# EAGLE design Link232-wifi-c64 (EAGLE 9.6.2)
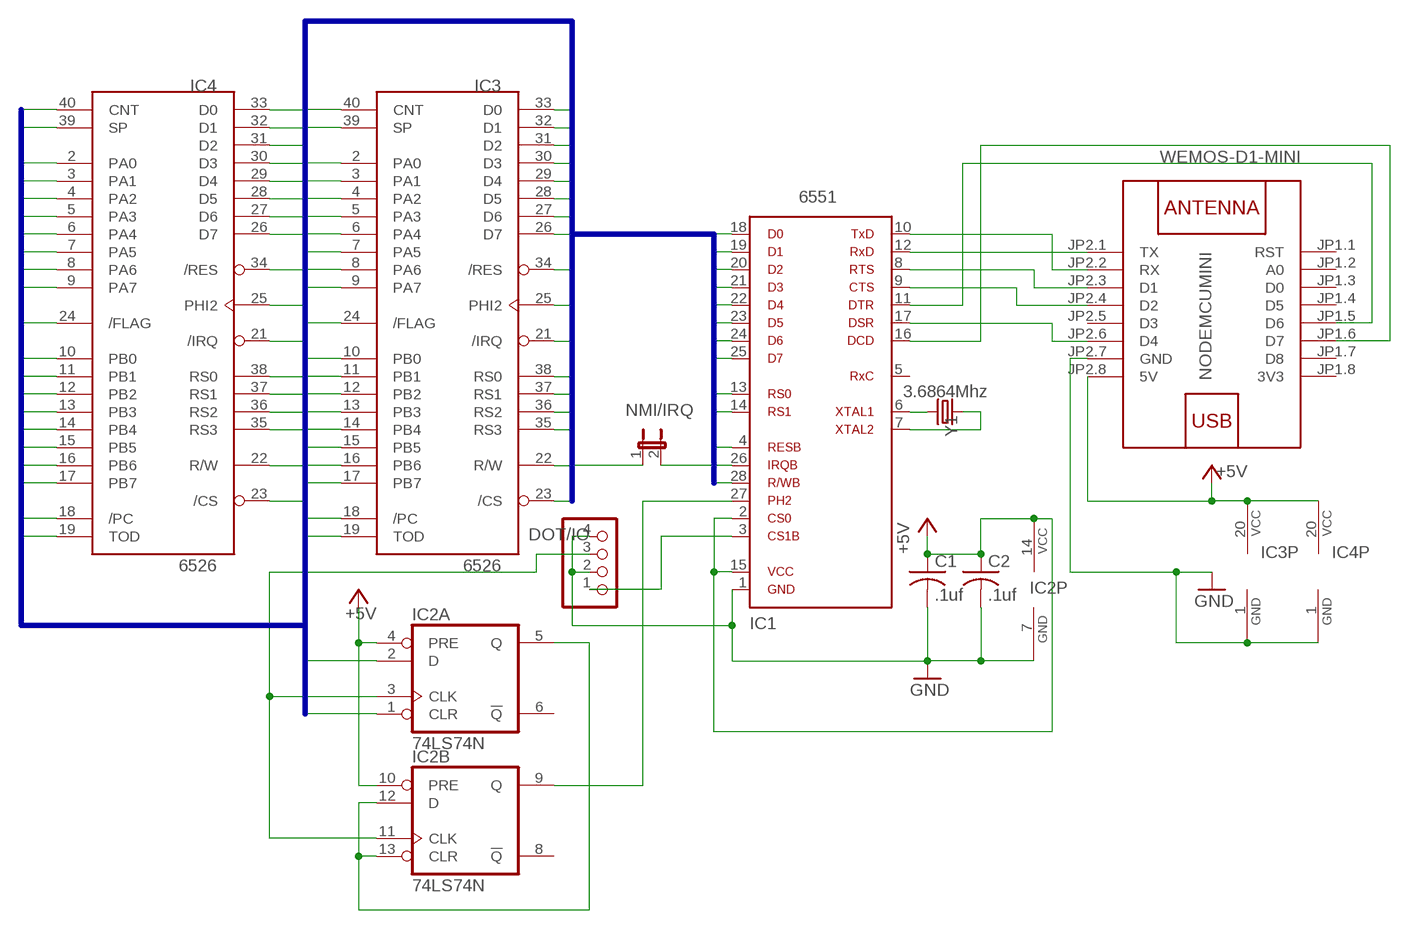
[diagram p0: schematic, sheet 1]

## Parts
C1  .1uf  C-US050-024X044  [C050-024X044]
C2  .1uf  C-US050-024X044  [C050-024X044]
IC1  6551  [6551]
IC2  74LS74N  [DIL14]
IC3  6526  [DIP40]
IC4  6526  [DIP40]
JP1  NMI/IRQ  JP1E  [JP1]
JP2  DOT/IO  PINHD-1X4  [1X04]
NODEMCUMINI  WEMOS-D1-MINI  [WEMOS-D1-MINI]
Y1  3.6864Mhz  CRYSTALPTH-HC49US  [HC49US]

## Nets
+5V: C1.1 C2.1 IC1.2 IC1.15 IC2.4(A:PRE) IC2.10(B:PRE) IC2.14(P:VCC) IC3.20(VCC) IC4.20(VCC) NODEMCUMINI.JP2.8(5V)
/CS: IC3.23(/CS) IC4.23(/CS)
/FLAG: IC3.24(/FLAG) IC4.24(/FLAG)
/PC: IC3.18(/PC) IC4.18(/PC)
CNT: IC3.40(CNT) IC4.40(CNT)
D0: IC1.18 IC3.33(D0) IC4.33(D0)
D1: IC1.19 IC3.32(D1) IC4.32(D1)
D2: IC1.20 IC3.31(D2) IC4.31(D2)
D3: IC1.21 IC3.30(D3) IC4.30(D3)
D4: IC1.22 IC3.29(D4) IC4.29(D4)
D5: IC1.23 IC3.28(D5) IC4.28(D5)
D6: IC1.24 IC3.27(D6) IC4.27(D6)
D7: IC1.25 IC3.26(D7) IC4.26(D7)
GND: C1.2 C2.2 IC1.1 IC2.7(P:GND) IC3.1(GND) IC4.1(GND) JP2.2 JP2.4 NODEMCUMINI.JP2.7(GND)
IRQ: IC3.21(/IRQ) IC4.21(/IRQ) JP1.1
N$1: IC2.3(A:CLK) IC2.11(B:CLK) JP2.3
N$2: IC2.5(A:Q) IC2.12(B:D) IC2.13(B:CLR)
N$3: IC1.27 IC2.9(B:Q)
N$4: IC1.26 JP1.2
N$5: IC1.3 JP2.1
N$9: IC1.6 Y1.2
N$10: IC1.7 Y1.1
N$11: IC1.12 NODEMCUMINI.JP2.1(TX)
N$12: IC1.10 NODEMCUMINI.JP2.2(RX)
N$13: IC1.8 NODEMCUMINI.JP2.3(D1)
N$14: IC1.9 NODEMCUMINI.JP2.4(D2)
N$15: IC1.17 NODEMCUMINI.JP2.6(D4)
N$16: IC1.11 NODEMCUMINI.JP1.5(D6)
N$17: IC1.16 NODEMCUMINI.JP1.6(D7)
PA0: IC3.2(PA0) IC4.2(PA0)
PA1: IC3.3(PA1) IC4.3(PA1)
PA2: IC3.4(PA2) IC4.4(PA2)
PA3: IC3.5(PA3) IC4.5(PA3)
PA4: IC3.6(PA4) IC4.6(PA4)
PA5: IC3.7(PA5) IC4.7(PA5)
PA6: IC3.8(PA6) IC4.8(PA6)
PA7: IC3.9(PA7) IC4.9(PA7)
PB0: IC3.10(PB0) IC4.10(PB0)
PB1: IC3.11(PB1) IC4.11(PB1)
PB2: IC3.12(PB2) IC4.12(PB2)
PB3: IC3.13(PB3) IC4.13(PB3)
PB4: IC3.14(PB4) IC4.14(PB4)
PB5: IC3.15(PB5) IC4.15(PB5)
PB6: IC3.16(PB6) IC4.16(PB6)
PB7: IC3.17(PB7) IC4.17(PB7)
PHI2: IC2.1(A:CLR) IC2.2(A:D) IC3.25(PHI2) IC4.25(PHI2)
RES: IC1.4 IC3.34(/RES) IC4.34(/RES)
RS0: IC1.13 IC3.38(RS0) IC4.38(RS0)
RS1: IC1.14 IC3.37(RS1) IC4.37(RS1)
RS2: IC3.36(RS2) IC4.36(RS2)
RS3: IC3.35(RS3) IC4.35(RS3)
RW: IC1.28 IC3.22(R/W) IC4.22(R/W)
SP: IC3.39(SP) IC4.39(SP)
TOD: IC3.19(TOD) IC4.19(TOD)
Unconnected: IC1.5 IC2.6(A:!Q) IC2.8(B:!Q) NODEMCUMINI.JP1.1(RST) NODEMCUMINI.JP1.2(A0) NODEMCUMINI.JP1.3(D0) NODEMCUMINI.JP1.4(D5) NODEMCUMINI.JP1.7(D8) NODEMCUMINI.JP2.5(D3)

## Buses
CNT,/CS,D0,D1,D2,D3,D4,D5,D6,D7,/FLAG,IRQ,PA0,PA1,PA2,PA3,PA4,PA5,PA6,PA7,PB0,PB1,PB2,PB3,PB4,PB5,PB6,PB7,/PC,PHI2,RES,RS0,RS1,RS2,RS3,RW,SP,TOD

## Power pins joined to a net without a drawn wire
3V3: NODEMCUMINI.JP1.8(3V3)

## Library data of the parts
C1 C2 = rcl:C-US: CAPACITOR, American symbol; SPICEPREFIX: C
IC1 = 65xx:6551: Dual In Line
IC2 = 74xx-us:74*74: Dual D type positive edge triggered FLIP FLOP, preset and clear
IC3 IC4 = 0RB_65xx:6526: I/O device: two 8-bits ports, handshake lines, timers. Used in C64 and C128.
JP1 = jumper:JP1E: JUMPER
JP2 = pinhead:PINHD-1X4: PIN HEADER
NODEMCUMINI = diy-modules:WEMOS-D1-MINI: WEMOS D1 mini: Mini Wi-Fi Board based on ESP-8266 device More details can be found here: https://www.wemos.cc/product/d1-mini.html Click here to find device on ebay.com <http://www.ebay.com/sch/wemos+d1+mini+nodemcu>
Y1 = SparkFun-Clocks:CRYSTAL: Crystals (Generic) These are passive quartz crystals, which can be used as a clock source for a microcontroller. Crystal's are two-terminal devices. They require external "load" capacitors to generate an oscillating signal.

## Board
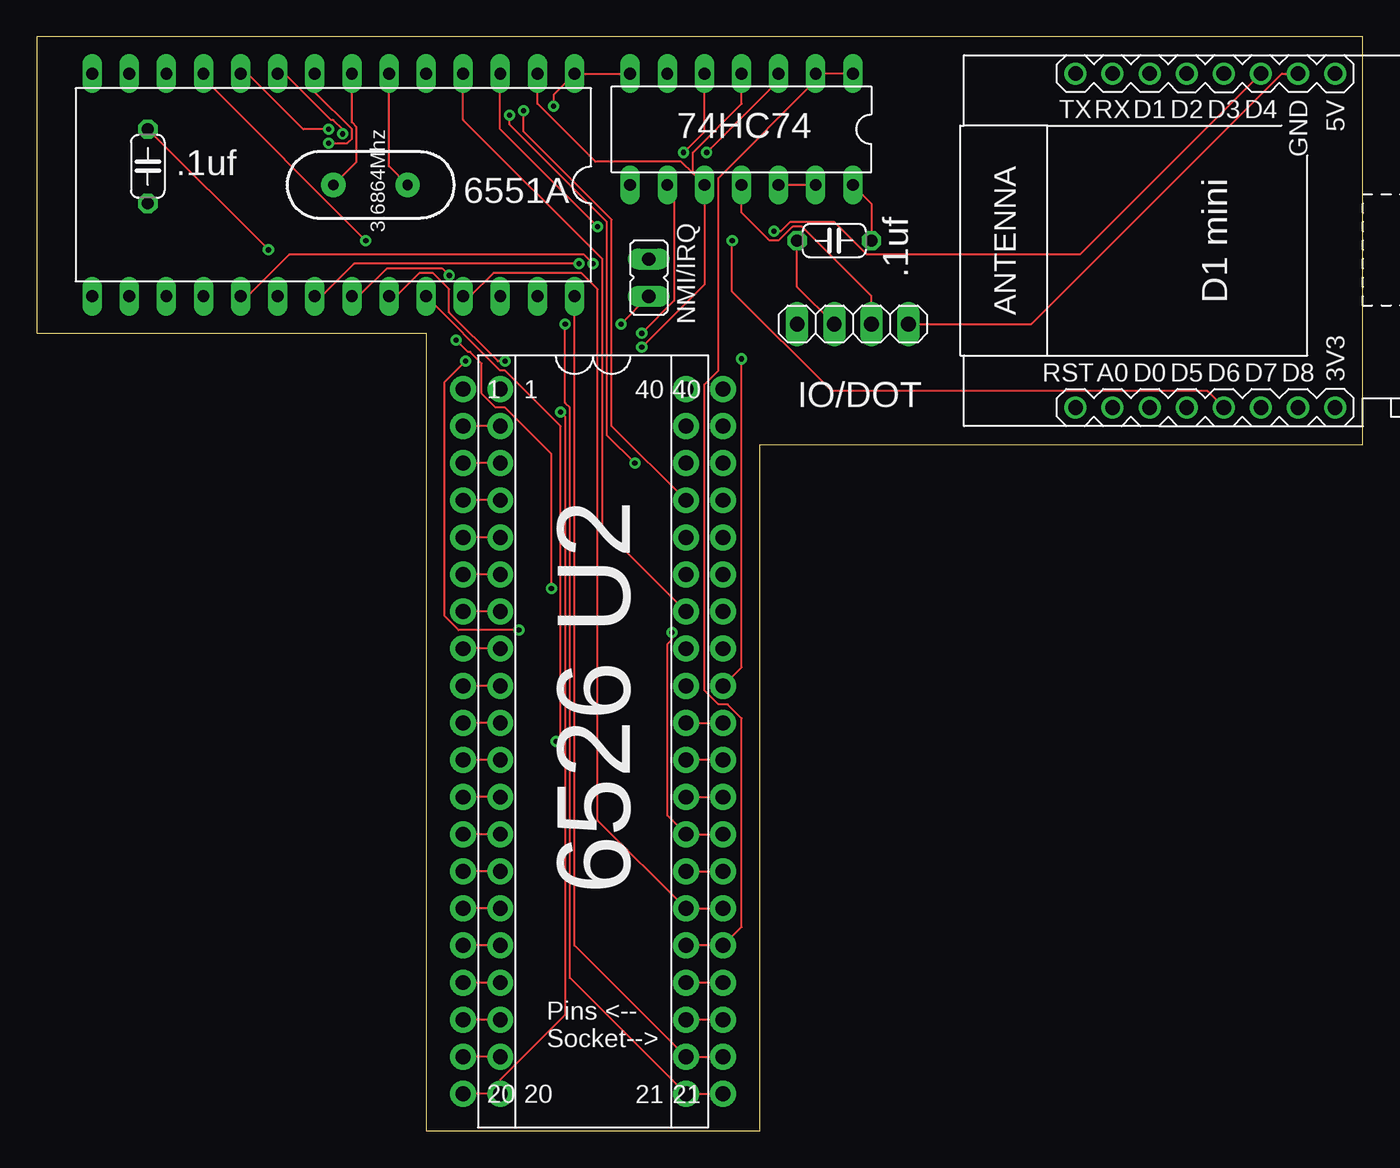
[diagram p1: board, top side]
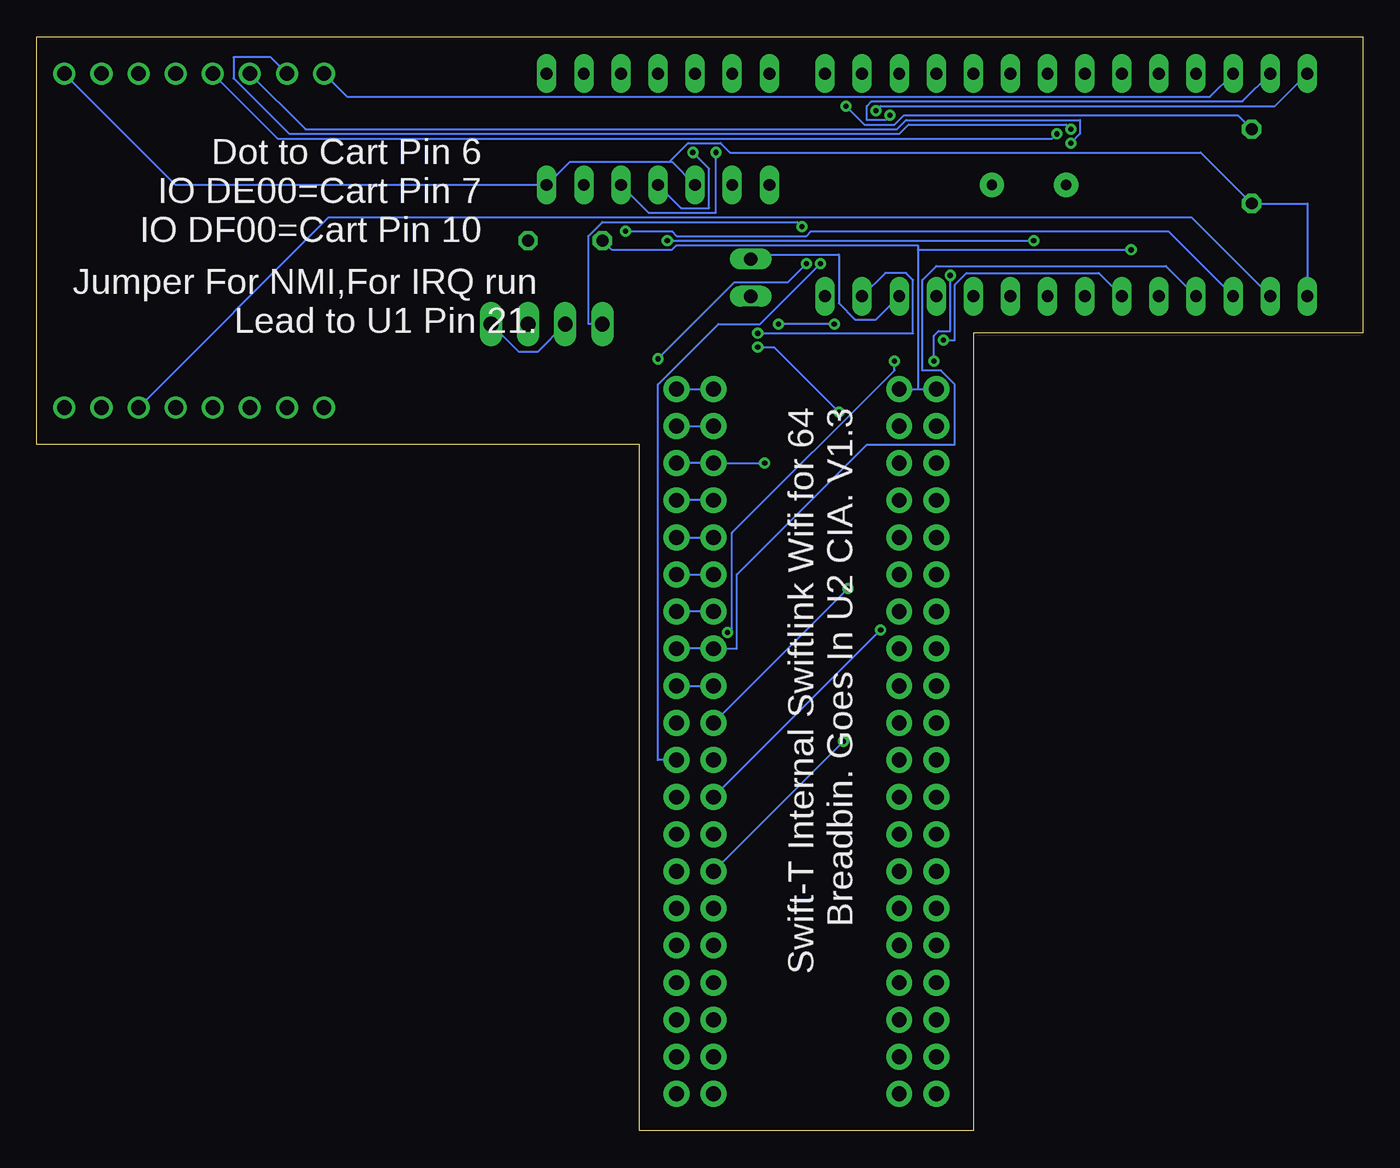
[diagram p2: board, bottom side, seen from below]

Size 90.81 x 74.93 mm. Coordinates in mm from the lower left corner, seen from the top.
Outline: 26.67,0 49.53,0 49.53,46.99 90.81,46.99 90.81,74.93 0,74.93 0,54.61 26.67,54.61 26.67,0
Copper layers (1*16): Top 0.035mm / dielectric 1.5mm / Bottom 0.035mm
Design rules "default": minimum track width 6mil, minimum drill 0.35mm, track to track 6mil, track to pad 6mil, pad to pad 6mil, via to via 6mil, smd to smd 6mil, copper to edge 40mil, drill to drill 6mil, minimum pad ring 10mil, minimum via ring 8mil, stop-mask expansion 4mil, vias tented up to drill 0mil, thermal gap 10mil

### Footprints (pad centres in the part's own frame; a part is rotated, then mirrored left to right if it is on the bottom)
C050-024X044 = drill 0.813 octagon: 1 -2.54,0; 2 2.54,0
6551 = drill 0.813 long: 1 -16.51,-7.62; 2 -13.97,-7.62; 3 -11.43,-7.62; 4 -8.89,-7.62; 5 -6.35,-7.62; 6 -3.81,-7.62; 7 -1.27,-7.62; 8 1.27,-7.62; 9 3.81,-7.62; 10 6.35,-7.62; 11 8.89,-7.62; 12 11.43,-7.62; 13 13.97,-7.62; 14 16.51,-7.62; 15 16.51,7.62; 16 13.97,7.62; 17 11.43,7.62; 18 8.89,7.62; 19 6.35,7.62; 20 3.81,7.62; 21 1.27,7.62; 22 -1.27,7.62; 23 -3.81,7.62; 24 -6.35,7.62; 25 -8.89,7.62; 26 -11.43,7.62; 27 -13.97,7.62; 28 -16.51,7.62
DIL14 = drill 0.813 long: 1 -7.62,-3.81; 2 -5.08,-3.81; 3 -2.54,-3.81; 4 0,-3.81; 5 2.54,-3.81; 6 5.08,-3.81; 7 7.62,-3.81; 8 7.62,3.81; 9 5.08,3.81; 10 2.54,3.81; 11 0,3.81; 12 -2.54,3.81; 13 -5.08,3.81; 14 -7.62,3.81
DIP40 = drill 1.016 pad 1.778: 1 -24.13,-7.62; 2 -21.59,-7.62; 3 -19.05,-7.62; 4 -16.51,-7.62; 5 -13.97,-7.62; 6 -11.43,-7.62; 7 -8.89,-7.62; 8 -6.35,-7.62; 9 -3.81,-7.62; 10 -1.27,-7.62; 11 1.27,-7.62; 12 3.81,-7.62; 13 6.35,-7.62; 14 8.89,-7.62; 15 11.43,-7.62; 16 13.97,-7.62; 17 16.51,-7.62; 18 19.05,-7.62; 19 21.59,-7.62; 20 24.13,-7.62; 21 24.13,7.62; 22 21.59,7.62; 23 19.05,7.62; 24 16.51,7.62; 25 13.97,7.62; 26 11.43,7.62; 27 8.89,7.62; 28 6.35,7.62; 29 3.81,7.62; 30 1.27,7.62; 31 -1.27,7.62; 32 -3.81,7.62; 33 -6.35,7.62; 34 -8.89,7.62; 35 -11.43,7.62; 36 -13.97,7.62; 37 -16.51,7.62; 38 -19.05,7.62; 39 -21.59,7.62; 40 -24.13,7.62
JP1 = drill 0.914 long: 1 0,-1.27; 2 0,1.27
1X04 = drill 1.016 long: 1 -3.81,0; 2 -1.27,0; 3 1.27,0; 4 3.81,0
WEMOS-D1-MINI = drill 1: JP1.1 -11.43,9.525; JP1.2 -11.43,6.985; JP1.3 -11.43,4.445; JP1.4 -11.43,1.905; JP1.5 -11.43,-0.635; JP1.6 -11.43,-3.175; JP1.7 -11.43,-5.715; JP1.8 -11.43,-8.255; JP2.1 11.43,9.525; JP2.2 11.43,6.985; JP2.3 11.43,4.445; JP2.4 11.43,1.905; JP2.5 11.43,-0.635; JP2.6 11.43,-3.175; JP2.7 11.43,-5.715; JP2.8 11.43,-8.255
HC49US = drill 0.7 pad 1.651: 1 -2.54,0; 2 2.54,0

### Placement (x,y rotation side)
C1  54.61,60.96 180 top
C2  7.62,66.04 90 top
IC1  20.32,64.77 180 top
IC2  48.26,68.58 180 top
IC3  36.83,26.67 270 top
IC4  39.37,26.67 270 top
JP1  41.91,58.42 0 top
JP2  55.88,55.25 0 top
NODEMCUMINI  80.65,60.96 90 top
Y1  22.86,64.77 0 top

### Tracks (layer width: path | path; a pad name or v marks a point on that pad's centre or on a via)
+5V  (via drill 0.35)
  Top 0.152: IC3.20 IC4.20 31.75,3.49 36.2,7.94 36.2,48.9 v35.88,49.21 | IC1.2 34.29,70.33 38.26,66.36 44.13,66.36 44.93,65.56 | 44.93,65.56 IC2.10 45.72,57.94 v41.43,53.66 | C1.1 57.15,63.5 IC2.14 | IC2.4 48.26,70.33 44.93,66.99 44.93,65.56
  Bottom 0.152: IC1.15 3.81,63.5 C2.1 11.11,66.99 43.34,66.99 43.97,67.63 46.2,67.63 47.47,66.36 | IC2.10 47.31,66.36 47.47,66.36 | 47.47,66.36 54.29,66.36 IC2.14 81.28,64.77 NODEMCUMINI.JP2.8 | v35.88,49.21 40.32,53.66 v41.43,53.66
/CS
  Top 0.152: IC4.23 IC3.23
/FLAG
  Top 0.152: IC4.24 IC3.24
/PC
  Top 0.152: IC4.18 IC3.18
CNT
  Bottom 0.152: IC4.40 IC3.40
D0
  Bottom 0.152: IC1.18 13.49,59.21 29.21,59.21 30.16,58.26 30.16,52.07 28.89,52.07 27.94,51.12 27.94,46.99 33.97,46.99 42.86,38.1 42.86,33.02 IC3.33 IC4.33
D1  (via drill 0.35)
  Top 0.152: IC1.19 14.45,57.15 17.3,60.01 37.47,60.01 v38.1,59.37 | v48.26,52.86 48.26,31.75 IC4.32
  Bottom 0.152: v38.1,59.37 39.37,58.1 43.02,58.1 v48.26,52.86 | IC4.32 IC3.32
D2  (via drill 0.35)
  Top 0.152: v28.73,54.13 29.53,53.34 29.69,53.34 30.48,52.55 30.48,50.48 31.43,49.53 32.07,49.53 35.24,46.36 v35.24,37.15 | IC3.31 IC4.31
  Bottom 0.152: IC1.20 18.1,58.74 27.15,58.74 27.94,57.94 27.94,54.13 v28.73,54.13 | IC3.31 v35.24,37.15
D3  (via drill 0.35)
  Top 0.152: IC1.21 19.53,57.15 21.75,59.37 v37.15,59.37 | IC4.30 IC3.30
  Bottom 0.152: v37.15,59.37 41.27,55.25 44.13,55.25 48.26,51.12 48.26,25.4 IC4.30
D4  (via drill 0.35)
  Top 0.152: IC1.22 22.07,57.15 23.97,59.05 27.78,59.05 v28.26,58.58 | v29.37,52.71 27.94,51.28 27.94,35.24 28.89,34.29 v33.02,34.29 | IC3.29 IC4.29
  Bottom 0.152: v28.26,58.58 28.26,54.77 29.05,54.77 29.37,54.45 v29.37,52.71 | IC3.29 v33.02,34.29
D5  (via drill 0.35)
  Top 0.152: IC1.23 24.61,57.15 26.19,58.74 27.15,58.74 28.26,57.63 28.26,56.04 31.59,52.71 v32.07,52.71 | v43.5,34.13 43.5,33.66 43.18,33.34 43.18,21.59 IC3.28 IC4.28
  Bottom 0.152: v32.07,52.71 32.07,52.07 43.18,40.96 43.18,34.13 v43.5,34.13
D6  (via drill 0.35)
  Top 0.152: IC1.24 31.75,52.07 32.07,52.07 35.88,48.26 35.88,26.99 v35.56,26.67 | IC3.27 IC4.27
  Bottom 0.152: IC3.27 v35.56,26.67
D7
  Top 0.152: IC1.25 29.69,57.15 31.27,58.74 37.31,58.74 38.42,57.63 38.42,21.27 IC3.26 IC4.26
GND  (via drill 0.35)
  Top 0.152: NODEMCUMINI.JP2.7 85.25,72.39 68.1,55.25 JP2.4 | v35.4,70.17 35.4,70.96 IC1.1 IC2.7 | C1.2 52.07,57.79 JP2.2 | v15.88,60.33 C2.2
  Bottom 0.152: C2.2 8.57,69.53 31.43,69.53 32.07,68.9 34.13,68.9 v35.4,70.17 | IC4.1 30.48,50.8 | 30.48,50.8 IC3.1 | 30.48,60.33 30.48,60.64 46.99,60.64 47.31,60.33 51.44,60.33 C1.2 | 30.48,60.33 30.48,50.8 | 30.48,60.33 v15.88,60.33 | JP2.4 57.79,53.34 56.51,53.34 JP2.2
IRQ  (via drill 0.35)
  Top 0.152: v40.01,55.25 JP1.1 | v36.2,55.25 36.2,49.85 36.51,49.53 36.51,10.48 IC3.21 IC4.21
  Bottom 0.152: v36.2,55.25 v40.01,55.25
N$1  (via drill 0.35)
  Top 0.152: IC2.11 48.26,62.87 50.16,60.96 50.8,60.96 51.75,61.91 52.39,61.91 57.15,57.15 JP2.3 | IC2.3 50.8,71.91 v45.88,66.99
  Bottom 0.152: v45.88,66.99 44.77,65.88 44.77,63.18 46.67,63.18 IC2.11
N$2  (via drill 0.35)
  Top 0.152: IC2.13 IC2.12 | IC2.5 45.72,68.42 v44.29,66.99
  Bottom 0.152: v44.29,66.99 44.29,62.87 48.9,62.87 IC2.12
N$3  (via drill 0.35)
  Top 0.152: v41.43,54.61 43.66,56.83 43.66,64.29 IC2.9
  Bottom 0.152: IC1.27 32.7,58.74 31.27,58.74 30.8,58.26 30.8,54.61 v41.43,54.61
N$4
  Bottom 0.152: IC1.26 33.34,55.56 34.77,55.56 35.88,56.67 35.88,60.01 41.59,60.01 JP1.2
N$5  (via drill 0.35)
  Top 0.152: IC1.3 31.75,68.58 v38.42,61.91
  Bottom 0.152: v38.42,61.91 38.73,62.23 52.07,62.23 53.02,61.28 53.02,55.25 JP2.1
N$9
  Top 0.152: IC1.6 24.13,66.04 Y1.2
N$10
  Top 0.152: IC1.7 21.59,69.06 21.91,68.74 21.91,66.36 Y1.1
N$11
  Bottom 0.152: IC1.12 10.48,70.8 69.53,70.8 NODEMCUMINI.JP2.1
N$12  (via drill 0.35)
  Top 0.152: IC1.10 14.45,72.39 18.26,68.58 v20,68.58
  Bottom 0.152: v20,68.58 20.32,68.9 31.12,68.9 31.75,68.26 73.5,68.26 77.31,72.07 77.31,73.5 74.77,73.5 NODEMCUMINI.JP2.2
N$13  (via drill 0.35)
  Top 0.152: IC1.8 19.05,71.12 21.59,68.58 21.59,67.94 21.27,67.63 v20,67.63
  Bottom 0.152: v20,67.63 19.37,68.26 19.37,69.21 31.27,69.21 31.91,68.58 72.39,68.58 NODEMCUMINI.JP2.3
N$14  (via drill 0.35)
  Top 0.152: IC1.9 16.99,72.39 20.16,69.21 20.32,69.21 20.95,68.58 v20.95,68.26
  Bottom 0.152: v20.95,68.26 21.27,67.94 74.29,67.94 NODEMCUMINI.JP2.4
N$15  (via drill 0.35)
  Top 0.152: v50.48,61.6 50.96,61.6 51.59,62.23 54.61,62.23 56.83,60.01 71.44,60.01 NODEMCUMINI.JP2.6
  Bottom 0.152: IC1.17 13.34,61.6 37.78,61.6 38.1,61.28 46.99,61.28 47.31,61.6 v50.48,61.6
N$16  (via drill 0.35)
  Top 0.152: IC1.11 11.43,72.07 v22.54,60.96 | v47.62,60.96 47.62,57.47 54.45,50.64 80.17,50.64 NODEMCUMINI.JP1.5
  Bottom 0.152: v47.62,60.96 v22.54,60.96
N$17
  Bottom 0.152: IC1.16 11.75,62.55 70.8,62.55 NODEMCUMINI.JP1.6
PA0
  Top 0.152: IC4.2 IC3.2
PA1
  Top 0.152: IC4.3 IC3.3
PA2
  Top 0.152: IC4.4 IC3.4
PA3
  Top 0.152: IC4.5 IC3.5
PA4
  Top 0.152: IC4.6 IC3.6
PA5
  Top 0.152: IC4.7 IC3.7
PA6
  Top 0.152: IC4.8 IC3.8
PA7
  Top 0.152: IC4.9 IC3.9
PB0
  Top 0.152: IC4.10 IC3.10
PB1
  Top 0.152: IC4.11 IC3.11
PB2
  Top 0.152: IC4.12 IC3.12
PB3
  Top 0.152: IC4.13 IC3.13
PB4
  Top 0.152: IC4.14 IC3.14
PB5
  Top 0.152: IC4.15 IC3.15
PB6
  Top 0.152: IC4.16 IC3.16
PB7
  Top 0.152: IC4.17 IC3.17
PHI2
  Top 0.152: IC2.1 IC2.2 53.34,71.91 46.67,65.25 46.67,52.07 45.72,51.12 45.72,30.16 46.67,29.21 47.31,29.21 48.26,28.26 48.26,13.97 IC4.25 IC3.25
RES
  Top 0.152: IC1.4 29.21,69.21 38.73,59.69 38.73,41.28 IC3.34
  Bottom 0.152: IC3.34 IC4.34
RS0  (via drill 0.35)
  Top 0.152: v32.38,69.53 32.38,68.9 39.05,62.23 39.05,47.62 v40.96,45.72
  Bottom 0.152: IC1.13 8.25,70.48 33.66,70.48 33.97,70.17 33.97,69.21 32.7,69.21 v32.38,69.53 | v40.96,45.72 IC3.38 IC4.38
RS1  (via drill 0.35)
  Top 0.152: v33.34,69.85 33.34,68.42 39.37,62.39 39.37,48.26 IC3.37
  Bottom 0.152: IC1.14 6.03,70.17 33.02,70.17 v33.34,69.85 | IC3.37 IC4.37
RS2
  Bottom 0.152: IC4.36 IC3.36
RS3
  Bottom 0.152: IC4.35 IC3.35
RW
  Top 0.152: IC1.28 36.83,12.7 IC3.22 IC4.22
SP
  Bottom 0.152: IC4.39 IC3.39
TOD
  Top 0.152: IC4.19 IC3.19

### Text on the board
tPlace: 3.6864Mhz | 74HC74 | .1uf | 6551A | .1uf | NMI/IRQ | IO/DOT | 6526 U2 | Pins <-- / Socket-->
bPlace: Dot to Cart Pin 6 / IO DE00=Cart Pin 7 / IO DF00=Cart Pin 10 | Jumper For NMI,For IRQ run / Lead to U1 Pin 21. | Swift-T Internal Swiftlink Wifi for 64 / Breadbin. Goes In U2 CIA. V1.3